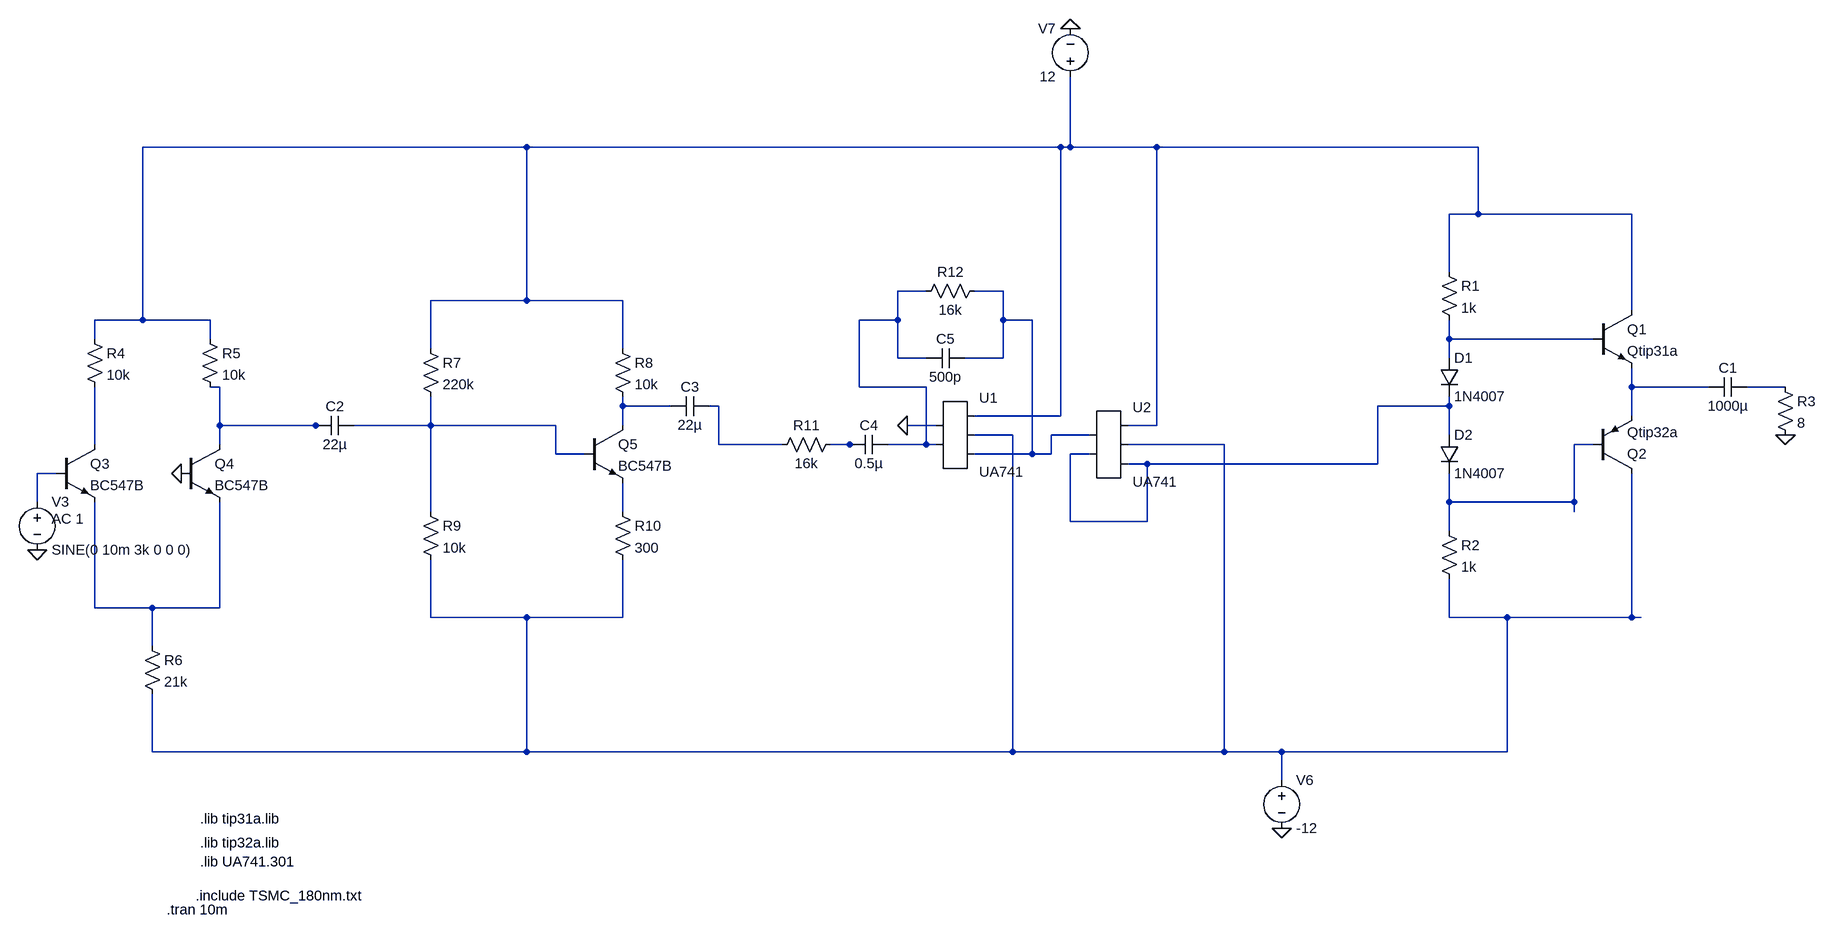
[diagram p0: schematic Draft5.asc]
Draft5.asc, the LTspice schematic file:
Version 4
SHEET 1 1640 832
WIRE -912 -704 -1552 -704
WIRE 48 -704 -912 -704
WIRE 64 -704 64 -848
WIRE 64 -704 48 -704
WIRE 208 -704 64 -704
WIRE 1072 -704 208 -704
WIRE 1072 -592 1072 -704
WIRE 1072 -592 1024 -592
WIRE 1328 -592 1072 -592
WIRE 1024 -496 1024 -592
WIRE -176 -464 -224 -464
WIRE -48 -464 -96 -464
WIRE -912 -448 -912 -704
WIRE -912 -448 -1072 -448
WIRE -752 -448 -912 -448
WIRE 1328 -432 1328 -592
WIRE -1552 -416 -1552 -704
WIRE -1552 -416 -1632 -416
WIRE -1440 -416 -1552 -416
WIRE -224 -416 -224 -464
WIRE -224 -416 -288 -416
WIRE -48 -416 -48 -464
WIRE 0 -416 -48 -416
WIRE -1632 -384 -1632 -416
WIRE -1440 -384 -1440 -416
WIRE 1024 -384 1024 -416
WIRE 1264 -384 1024 -384
WIRE -1072 -368 -1072 -448
WIRE -752 -368 -752 -448
WIRE -224 -352 -224 -416
WIRE -176 -352 -224 -352
WIRE -48 -352 -48 -416
WIRE -48 -352 -112 -352
WIRE 1024 -352 1024 -384
WIRE -1424 -304 -1440 -304
WIRE -288 -304 -288 -416
WIRE -176 -304 -288 -304
WIRE 1328 -304 1328 -336
WIRE 1456 -304 1328 -304
WIRE 1584 -304 1520 -304
WIRE -752 -272 -752 -288
WIRE -672 -272 -752 -272
WIRE -592 -272 -608 -272
WIRE 1024 -272 1024 -288
WIRE 1024 -272 576 -272
WIRE 48 -256 48 -704
WIRE 48 -256 -96 -256
WIRE 1328 -256 1328 -304
WIRE -1424 -240 -1424 -304
WIRE -1264 -240 -1424 -240
WIRE -1248 -240 -1264 -240
WIRE -1072 -240 -1072 -288
WIRE -1072 -240 -1200 -240
WIRE -864 -240 -1072 -240
WIRE -752 -240 -752 -272
WIRE -160 -240 -208 -240
WIRE 208 -240 208 -704
WIRE 208 -240 160 -240
WIRE -32 -224 -96 -224
WIRE 96 -224 32 -224
WIRE 1024 -224 1024 -272
WIRE -1632 -208 -1632 -304
WIRE -1424 -208 -1424 -240
WIRE -592 -208 -592 -272
WIRE -416 -208 -592 -208
WIRE -304 -208 -336 -208
WIRE -288 -208 -304 -208
WIRE -176 -208 -176 -304
WIRE -176 -208 -240 -208
WIRE -160 -208 -176 -208
WIRE 320 -208 160 -208
WIRE 1264 -208 1232 -208
WIRE -864 -192 -864 -240
WIRE -816 -192 -864 -192
WIRE 0 -192 0 -416
WIRE 0 -192 -96 -192
WIRE 32 -192 32 -224
WIRE 32 -192 0 -192
WIRE 96 -192 64 -192
WIRE 192 -176 160 -176
WIRE 576 -176 576 -272
WIRE 576 -176 192 -176
WIRE -1696 -160 -1728 -160
WIRE -1728 -112 -1728 -160
WIRE 1024 -112 1024 -160
WIRE 1232 -112 1232 -208
WIRE 1232 -112 1024 -112
WIRE -1072 -96 -1072 -240
WIRE -752 -96 -752 -144
WIRE 1232 -96 1232 -112
WIRE 64 -80 64 -192
WIRE 192 -80 192 -176
WIRE 192 -80 64 -80
WIRE 1024 -64 1024 -112
WIRE -1632 64 -1632 -112
WIRE -1536 64 -1632 64
WIRE -1424 64 -1424 -112
WIRE -1424 64 -1536 64
WIRE -1072 80 -1072 -16
WIRE -912 80 -1072 80
WIRE -752 80 -752 -16
WIRE -752 80 -912 80
WIRE 1024 80 1024 16
WIRE 1120 80 1024 80
WIRE 1328 80 1328 -160
WIRE 1328 80 1120 80
WIRE 1344 80 1328 80
WIRE -1536 128 -1536 64
WIRE -1536 304 -1536 208
WIRE -912 304 -912 80
WIRE -912 304 -1536 304
WIRE -32 304 -32 -224
WIRE -32 304 -912 304
WIRE 320 304 320 -208
WIRE 320 304 -32 304
WIRE 416 304 320 304
WIRE 1120 304 1120 80
WIRE 1120 304 416 304
WIRE 416 352 416 304
FLAG 1584 -224 0
FLAG -1728 -32 0
FLAG 416 432 0
FLAG 64 -928 0
FLAG -208 -240 0
FLAG -1488 -160 0
DATAFLAG -1536 64 ""
DATAFLAG 240 -208 ""
DATAFLAG 384 -176 ""
SYMBOL npn 1264 -432 R0
SYMATTR InstName Q1
SYMATTR Value Qtip31a
SYMBOL res 1008 -512 R0
SYMATTR InstName R1
SYMATTR Value 1k
SYMBOL diode 1008 -352 R0
SYMATTR InstName D1
SYMATTR Value 1N4007
SYMBOL diode 1008 -224 R0
SYMATTR InstName D2
SYMATTR Value 1N4007
SYMBOL res 1008 -80 R0
SYMATTR InstName R2
SYMATTR Value 1k
SYMBOL pnp 1264 -160 M180
SYMATTR InstName Q2
SYMATTR Value Qtip32a
SYMBOL res 1568 -320 R0
SYMATTR InstName R3
SYMATTR Value 8
SYMBOL cap 1520 -320 R90
WINDOW 0 0 32 VBottom 2
WINDOW 3 32 32 VTop 2
SYMATTR InstName C1
SYMATTR Value 1000µ
SYMBOL npn -1696 -208 R0
SYMATTR InstName Q3
SYMATTR Value BC547B
SYMBOL npn -1488 -208 R0
SYMATTR InstName Q4
SYMATTR Value BC547B
SYMBOL res -1648 -400 R0
SYMATTR InstName R4
SYMATTR Value 10k
SYMBOL res -1456 -400 R0
SYMATTR InstName R5
SYMATTR Value 10k
SYMBOL res -1552 112 R0
SYMATTR InstName R6
SYMATTR Value 21k
SYMBOL voltage -1728 -128 R0
WINDOW 123 24 44 Left 2
WINDOW 39 0 0 Left 0
SYMATTR Value2 AC 1
SYMATTR InstName V3
SYMATTR Value SINE(0 10m 3k 0 0 0)
SYMBOL cap -1200 -256 R90
WINDOW 0 0 32 VBottom 2
WINDOW 3 32 32 VTop 2
SYMATTR InstName C2
SYMATTR Value 22µ
SYMBOL res -1088 -384 R0
SYMATTR InstName R7
SYMATTR Value 220k
SYMBOL res -768 -384 R0
SYMATTR InstName R8
SYMATTR Value 10k
SYMBOL res -1088 -112 R0
SYMATTR InstName R9
SYMATTR Value 10k
SYMBOL res -768 -112 R0
SYMATTR InstName R10
SYMATTR Value 300
SYMBOL npn -816 -240 R0
SYMATTR InstName Q5
SYMATTR Value BC547B
SYMBOL cap -672 -256 R270
WINDOW 0 32 32 VTop 2
WINDOW 3 0 32 VBottom 2
SYMATTR InstName C3
SYMATTR Value 22µ
SYMBOL voltage 416 336 R0
WINDOW 123 0 0 Left 0
WINDOW 39 0 0 Left 0
SYMATTR InstName V6
SYMATTR Value -12
SYMBOL voltage 64 -832 R180
WINDOW 0 24 96 Left 2
WINDOW 3 24 16 Left 2
WINDOW 123 0 0 Left 0
WINDOW 39 0 0 Left 0
SYMATTR InstName V7
SYMATTR Value 12
SYMBOL res -320 -224 R90
WINDOW 0 0 56 VBottom 2
WINDOW 3 32 56 VTop 2
SYMATTR InstName R11
SYMATTR Value 16k
SYMBOL res -80 -480 R90
WINDOW 0 0 56 VBottom 2
WINDOW 3 32 56 VTop 2
SYMATTR InstName R12
SYMATTR Value 16k
SYMBOL cap -240 -224 R90
WINDOW 0 0 32 VBottom 2
WINDOW 3 32 32 VTop 2
SYMATTR InstName C4
SYMATTR Value 0.5µ
SYMBOL cap -112 -368 R90
WINDOW 0 0 32 VBottom 2
WINDOW 3 32 32 VTop 2
SYMATTR InstName C5
SYMATTR Value 500p
SYMBOL AutoGenerated\\UA741 -128 -224 R0
SYMATTR InstName U1
SYMBOL AutoGenerated\\UA741 128 -208 R0
SYMATTR InstName U2
TEXT -1456 488 Left 2 !.lib UA741.301
TEXT -1456 416 Left 2 !.lib tip31a.lib
TEXT -1456 456 Left 2 !.lib tip32a.lib
TEXT -1464 544 Left 2 !.include TSMC_180nm.txt
TEXT -1512 568 Left 2 !.tran 10m

The netlist it stands for:
* Draft5.asc
Q1 N001 N004 N006 0 Qtip31a
R1 N001 N004 1k
D1 N004 N010 1N4007
D2 N010 N015 1N4007
R2 N015 N012 1k
Q2 N012 N015 N006 0 Qtip32a
R3 N007 0 8
C1 N007 N006 1000µ
Q3 N013 N016 N018 0 BC547B
Q4 N005 0 N018 0 BC547B
R4 N001 N013 10k
R5 N001 N005 10k
R6 N018 N012 21k
V3 N016 0 SINE(0 10m 3k 0 0 0) AC 1
C2 N011 N005 22µ
R7 N001 N011 220k
R8 N001 N008 10k
R9 N011 N012 10k
R10 N017 N012 300
Q5 N008 N011 N017 0 BC547B
C3 N008 N009 22µ
V6 N012 0 -12
V7 N001 0 12
R11 N014 N009 16k
R12 N003 N002 16k
C4 N002 N014 0.5µ
C5 N003 N002 500p
* U1: UA741 (symbol AutoGenerated\UA741 not available, pins judged from their places): pin1=0 pin2=N002 pin3=N001 pin4=N012 pin5=N003
* U2: UA741 (symbol AutoGenerated\UA741 not available, pins judged from their places): pin1=N003 pin2=N010 pin3=N001 pin4=N012 pin5=N010
.model D D
.lib standard.dio
.model NPN NPN
.model PNP PNP
.lib standard.bjt
.lib UA741.301
.lib tip31a.lib
.lib tip32a.lib
.include TSMC_180nm.txt
.tran 10m
.backanno
.end